# EAGLE design MS-PB16 (EAGLE 6.2)
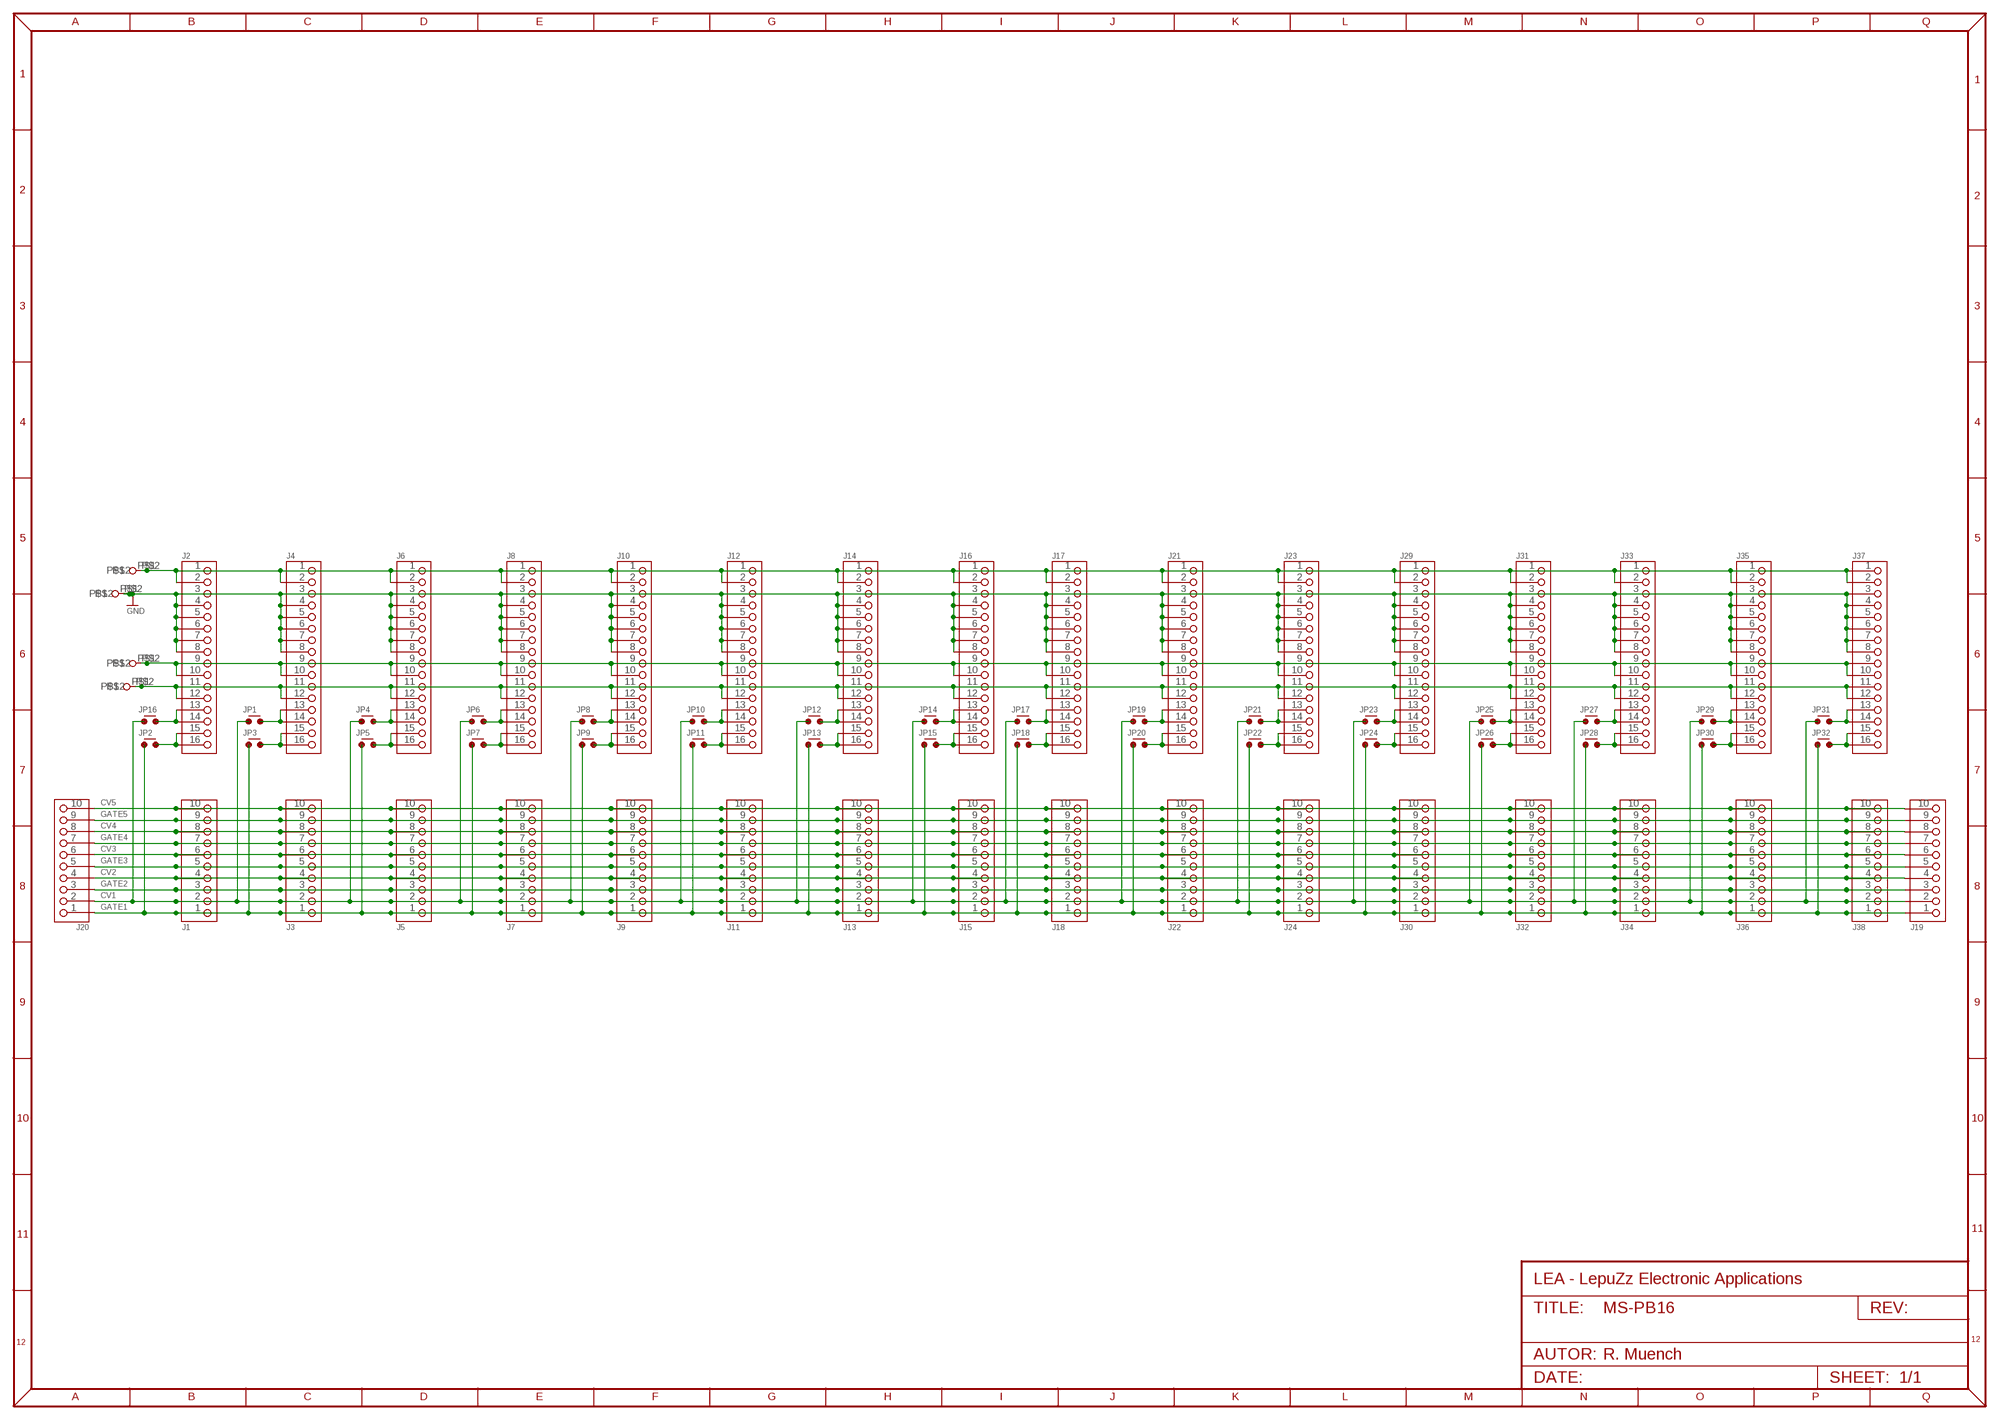
[diagram p0: schematic, sheet 1]

## Parts
J1  CON10PD_S  [PD10S]
J2  CON16_PDS  [PD16S]
J3  CON10PD_S  [PD10S]
J4  CON16_PDS  [PD16S]
J5  CON10PD_S  [PD10S]
J6  CON16_PDS  [PD16S]
J7  CON10PD_S  [PD10S]
J8  CON16_PDS  [PD16S]
J9  CON10PD_S  [PD10S]
J10  CON16_PDS  [PD16S]
J11  CON10PD_S  [PD10S]
J12  CON16_PDS  [PD16S]
J13  CON10PD_S  [PD10S]
J14  CON16_PDS  [PD16S]
J15  CON10PD_S  [PD10S]
J16  CON16_PDS  [PD16S]
J17  CON16_PDS  [PD16S]
J18  CON10PD_S  [PD10S]
J19  CON10PD_S  [PD10S]
J20  CON10PD_S  [PD10S]
J21  CON16_PDS  [PD16S]
J22  CON10PD_S  [PD10S]
J23  CON16_PDS  [PD16S]
J24  CON10PD_S  [PD10S]
J25  FLACHSTECKER-6,35  [FLACHSTECKER-6,35]
J26  FLACHSTECKER-6,35  [FLACHSTECKER-6,35]
J27  FLACHSTECKER-6,35  [FLACHSTECKER-6,35]
J28  FLACHSTECKER-6,35  [FLACHSTECKER-6,35]
J29  CON16_PDS  [PD16S]
J30  CON10PD_S  [PD10S]
J31  CON16_PDS  [PD16S]
J32  CON10PD_S  [PD10S]
J33  CON16_PDS  [PD16S]
J34  CON10PD_S  [PD10S]
J35  CON16_PDS  [PD16S]
J36  CON10PD_S  [PD10S]
J37  CON16_PDS  [PD16S]
J38  CON10PD_S  [PD10S]
JP1  JUMP2J2  [JUMP2]
JP2  JUMP2J2  [JUMP2]
JP3  JUMP2J2  [JUMP2]
JP4  JUMP2J2  [JUMP2]
JP5  JUMP2J2  [JUMP2]
JP6  JUMP2J2  [JUMP2]
JP7  JUMP2J2  [JUMP2]
JP8  JUMP2J2  [JUMP2]
JP9  JUMP2J2  [JUMP2]
JP10  JUMP2J2  [JUMP2]
JP11  JUMP2J2  [JUMP2]
JP12  JUMP2J2  [JUMP2]
JP13  JUMP2J2  [JUMP2]
JP14  JUMP2J2  [JUMP2]
JP15  JUMP2J2  [JUMP2]
JP16  JUMP2J2  [JUMP2]
JP17  JUMP2J2  [JUMP2]
JP18  JUMP2J2  [JUMP2]
JP19  JUMP2J2  [JUMP2]
JP20  JUMP2J2  [JUMP2]
JP21  JUMP2J2  [JUMP2]
JP22  JUMP2J2  [JUMP2]
JP23  JUMP2J2  [JUMP2]
JP24  JUMP2J2  [JUMP2]
JP25  JUMP2J2  [JUMP2]
JP26  JUMP2J2  [JUMP2]
JP27  JUMP2J2  [JUMP2]
JP28  JUMP2J2  [JUMP2]
JP29  JUMP2J2  [JUMP2]
JP30  JUMP2J2  [JUMP2]
JP31  JUMP2J2  [JUMP2]
JP32  JUMP2J2  [JUMP2]

## Nets
+5V: J2.11 J2.12 J4.11 J4.12 J6.11 J6.12 J8.11 J8.12 J10.11 J10.12 J12.11 J12.12 J14.11 J14.12 J16.11 J16.12 J17.11 J17.12 J21.11 J21.12 J23.11 J23.12 J27.P$1 J27.P$2 J29.11 J29.12 J31.11 J31.12 J33.11 J33.12 J35.11 J35.12 J37.11 J37.12
+12V: J2.9 J2.10 J4.9 J4.10 J6.9 J6.10 J8.9 J8.10 J10.9 J10.10 J12.9 J12.10 J14.9 J14.10 J16.9 J16.10 J17.9 J17.10 J21.9 J21.10 J23.9 J23.10 J26.P$1 J26.P$2 J29.9 J29.10 J31.9 J31.10 J33.9 J33.10 J35.9 J35.10 J37.9 J37.10
-12V: J2.1 J2.2 J4.1 J4.2 J6.1 J6.2 J8.1 J8.2 J10.1 J10.2 J12.1 J12.2 J14.1 J14.2 J16.1 J16.2 J17.1 J17.2 J21.1 J21.2 J23.1 J23.2 J25.P$1 J25.P$2 J29.1 J29.2 J31.1 J31.2 J33.1 J33.2 J35.1 J35.2 J37.1 J37.2
CV1: J1.2 J3.2 J5.2 J7.2 J9.2 J11.2 J13.2 J15.2 J18.2 J19.2 J20.2 J22.2 J24.2 J30.2 J32.2 J34.2 J36.2 J38.2 JP1.1 JP4.1 JP6.1 JP8.1 JP10.1 JP12.1 JP14.1 JP16.1 JP17.1 JP19.1 JP21.1 JP23.1 JP25.1 JP27.1 JP29.1 JP31.1
CV2: J1.4 J3.4 J5.4 J7.4 J9.4 J11.4 J13.4 J15.4 J18.4 J19.4 J20.4 J22.4 J24.4 J30.4 J32.4 J34.4 J36.4 J38.4
CV3: J1.6 J3.6 J5.6 J7.6 J9.6 J11.6 J13.6 J15.6 J18.6 J19.6 J20.6 J22.6 J24.6 J30.6 J32.6 J34.6 J36.6 J38.6
CV4: J1.8 J3.8 J5.8 J7.8 J9.8 J11.8 J13.8 J15.8 J18.8 J19.8 J20.8 J22.8 J24.8 J30.8 J32.8 J34.8 J36.8 J38.8
CV5: J1.10 J3.10 J5.10 J7.10 J9.10 J11.10 J13.10 J15.10 J18.10 J19.10 J20.10 J22.10 J24.10 J30.10 J32.10 J34.10 J36.10 J38.10
GATE1: J1.1 J3.1 J5.1 J7.1 J9.1 J11.1 J13.1 J15.1 J18.1 J19.1 J20.1 J22.1 J24.1 J30.1 J32.1 J34.1 J36.1 J38.1 JP2.1 JP3.1 JP5.1 JP7.1 JP9.1 JP11.1 JP13.1 JP15.1 JP18.1 JP20.1 JP22.1 JP24.1 JP26.1 JP28.1 JP30.1 JP32.1
GATE2: J1.3 J3.3 J5.3 J7.3 J9.3 J11.3 J13.3 J15.3 J18.3 J19.3 J20.3 J22.3 J24.3 J30.3 J32.3 J34.3 J36.3 J38.3
GATE3: J1.5 J3.5 J5.5 J7.5 J9.5 J11.5 J13.5 J15.5 J18.5 J19.5 J20.5 J22.5 J24.5 J30.5 J32.5 J34.5 J36.5 J38.5
GATE4: J1.7 J3.7 J5.7 J7.7 J9.7 J11.7 J13.7 J15.7 J18.7 J19.7 J20.7 J22.7 J24.7 J30.7 J32.7 J34.7 J36.7 J38.7
GATE5: J1.9 J3.9 J5.9 J7.9 J9.9 J11.9 J13.9 J15.9 J18.9 J19.9 J20.9 J22.9 J24.9 J30.9 J32.9 J34.9 J36.9 J38.9
GND: J2.3 J2.4 J2.5 J2.6 J2.7 J2.8 J4.3 J4.4 J4.5 J4.6 J4.7 J4.8 J6.3 J6.4 J6.5 J6.6 J6.7 J6.8 J8.3 J8.4 J8.5 J8.6 J8.7 J8.8 J10.3 J10.4 J10.5 J10.6 J10.7 J10.8 J12.3 J12.4 J12.5 J12.6 J12.7 J12.8 J14.3 J14.4 J14.5 J14.6 J14.7 J14.8 J16.3 J16.4 J16.5 J16.6 J16.7 J16.8 J17.3 J17.4 J17.5 J17.6 J17.7 J17.8 J21.3 J21.4 J21.5 J21.6 J21.7 J21.8 J23.3 J23.4 J23.5 J23.6 J23.7 J23.8 J28.P$1 J28.P$2 J29.3 J29.4 J29.5 J29.6 J29.7 J29.8 J31.3 J31.4 J31.5 J31.6 J31.7 J31.8 J33.3 J33.4 J33.5 J33.6 J33.7 J33.8 J35.3 J35.4 J35.5 J35.6 J35.7 J35.8 J37.3 J37.4 J37.5 J37.6 J37.7 J37.8
N$1: J4.13 J4.14 JP1.2
N$2: J2.15 J2.16 JP2.2
N$3: J2.13 J2.14 JP16.2
N$4: J4.15 J4.16 JP3.2
N$5: J6.13 J6.14 JP4.2
N$6: J6.15 J6.16 JP5.2
N$7: J8.15 J8.16 JP7.2
N$8: J8.13 J8.14 JP6.2
N$9: J10.13 J10.14 JP8.2
N$10: J10.15 J10.16 JP9.2
N$11: J12.13 J12.14 JP10.2
N$12: J12.15 J12.16 JP11.2
N$13: J14.13 J14.14 JP12.2
N$14: J14.15 J14.16 JP13.2
N$15: J16.13 J16.14 JP14.2
N$16: J16.15 J16.16 JP15.2
N$17: J17.13 J17.14 JP17.2
N$18: J17.15 J17.16 JP18.2
N$19: J21.13 J21.14 JP19.2
N$20: J21.15 J21.16 JP20.2
N$21: J23.13 J23.14 JP21.2
N$22: J23.15 J23.16 JP22.2
N$23: J29.13 J29.14 JP23.2
N$24: J29.15 J29.16 JP24.2
N$25: J31.13 J31.14 JP25.2
N$26: J31.15 J31.16 JP26.2
N$27: J33.13 J33.14 JP27.2
N$28: J33.15 J33.16 JP28.2
N$29: J35.13 J35.14 JP29.2
N$30: J35.15 J35.16 JP30.2
N$31: J37.13 J37.14 JP31.2
N$32: J37.15 J37.16 JP32.2

## Library data of the parts
J1 J3 J5 J7 J9 J11 J13 J15 J18-J20 J22 J24 J30 J32 J34 J36 J38 = PLUG:CON10: 10pol. Verbinder; ARTNUM: XXX-XXX
J2 J4 J6 J8 J10 J12 J14 J16 J17 J21 J23 J29 J31 J33 J35 J37 = PLUG:CON16: Steckverbinder 16polig; ARTNUM: XXX-XXX
J25-J28 = synth:FLACHSTECKER-6,35
JP1-JP32 = SWITCH:JUMP2

## Board
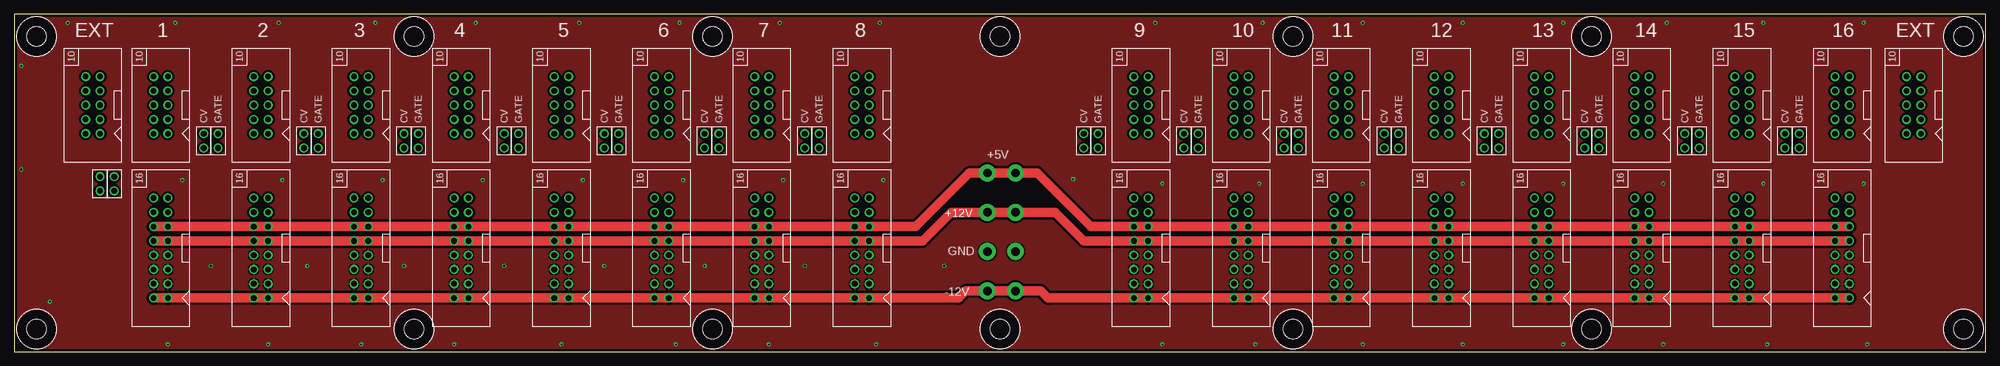
[diagram p1: board, top side]
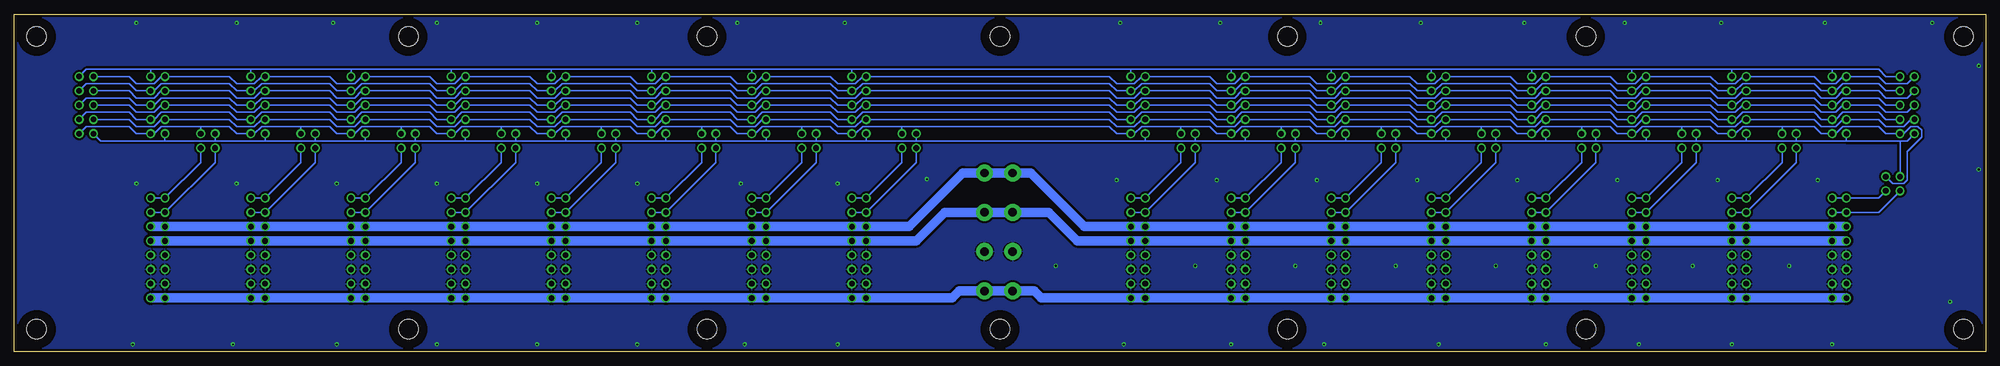
[diagram p2: board, bottom side, seen from below]

Size 350 x 60 mm. Coordinates in mm from the lower left corner, seen from the top.
Outline: 0,0 350,0 350,60 0,60 0,0
Copper layers (1*16): Top 0.035mm / dielectric 1.5mm / Bottom 0.035mm
Design rules: minimum track width 10mil, minimum drill 22mil, track to track 8mil, track to pad 8mil, pad to pad 8mil, via to via 8mil, smd to smd 8mil, copper to edge 20mil, drill to drill 8mil, minimum pad ring 10mil, minimum via ring 8mil, stop-mask expansion 4mil, vias tented up to drill 0mil, thermal gap 10mil

### Footprints (pad centres in the part's own frame; a part is rotated, then mirrored left to right if it is on the bottom)
PD10S = drill 1 pad 1.575: 1 -5.08,-1.27; 2 -5.08,1.27; 3 -2.54,-1.27; 4 -2.54,1.27; 5 0,-1.27; 6 0,1.27; 7 2.54,-1.27; 8 2.54,1.27; 9 5.08,-1.27; 10 5.08,1.27
PD16S = drill 1 pad 1.575: 1 -8.89,-1.27; 2 -8.89,1.27; 3 -6.35,-1.27; 4 -6.35,1.27; 5 -3.81,-1.27; 6 -3.81,1.27; 7 -1.27,-1.27; 8 -1.27,1.27; 9 1.27,-1.27; 10 1.27,1.27; 11 3.81,-1.27; 12 3.81,1.27; 13 6.35,-1.27; 14 6.35,1.27; 15 8.89,-1.27; 16 8.89,1.27
FLACHSTECKER-6,35 = drill 1.5 pad 3: P$1 0,2.5; P$2 0,-2.5
JUMP2 = drill 1 pad 1.575: 1 -1.27,0; 2 1.27,0
BF3,5 = hole 3.5: 0,0

### Placement (x,y rotation side)
J1  26.04,43.81 90 top
J2  26.04,18.41 90 top
J3  43.81,43.81 90 top
J4  43.81,18.41 90 top
J5  61.59,43.81 90 top
J6  61.59,18.41 90 top
J7  79.38,43.81 90 top
J8  79.38,18.41 90 top
J9  97.16,43.81 90 top
J10  97.16,18.41 90 top
J11  114.94,43.81 90 top
J12  114.94,18.41 90 top
J13  132.72,43.81 90 top
J14  132.72,18.41 90 top
J15  150.5,43.81 90 top
J16  150.5,18.41 90 top
J17  200.03,18.41 90 top
J18  200.03,43.81 90 top
J19  13.97,43.81 90 top
J20  337.19,43.81 90 top
J21  217.81,18.41 90 top
J22  217.81,43.81 90 top
J23  235.59,18.41 90 top
J24  235.59,43.81 90 top
J25  175.26,10.79 90 top
J26  175.26,24.77 90 top
J27  175.26,31.75 90 top
J28  175.26,17.78 90 top
J29  253.37,18.41 90 top
J30  253.37,43.81 90 top
J31  271.14,18.41 90 top
J32  271.14,43.81 90 top
J33  288.93,18.41 90 top
J34  288.93,43.81 90 top
J35  306.7,18.41 90 top
J36  306.7,43.81 90 top
J37  324.49,18.41 90 top
J38  324.49,43.81 90 top
JP1  33.66,37.47 270 top
JP2  17.78,29.84 270 top
JP3  36.2,37.47 270 top
JP4  51.44,37.47 270 top
JP5  53.98,37.47 270 top
JP6  69.22,37.47 270 top
JP7  71.75,37.47 270 top
JP8  87,37.47 270 top
JP9  89.53,37.47 270 top
JP10  104.78,37.47 270 top
JP11  107.31,37.47 270 top
JP12  122.56,37.47 270 top
JP13  125.09,37.47 270 top
JP14  140.34,37.47 270 top
JP15  142.88,37.47 270 top
JP16  15.24,29.84 270 top
JP17  189.87,37.47 270 top
JP18  192.41,37.47 270 top
JP19  207.65,37.47 270 top
JP20  210.19,37.47 270 top
JP21  225.43,37.47 270 top
JP22  227.97,37.47 270 top
JP23  243.21,37.47 270 top
JP24  245.75,37.47 270 top
JP25  260.99,37.47 270 top
JP26  263.52,37.47 270 top
JP27  278.76,37.47 270 top
JP28  281.31,37.47 270 top
JP29  296.55,37.47 270 top
JP30  299.08,37.47 270 top
JP31  314.32,37.47 270 top
JP32  316.87,37.47 270 top
U$1  [BF3,5]  227,4 0 top
U$2  [BF3,5]  227,56 0 top
U$4  [BF3,5]  346,56 0 top
U$5  [BF3,5]  346,4 0 top
U$6  [BF3,5]  280,56 0 top
U$7  [BF3,5]  280,4 0 top
U$21  [LEA-MASK]  8.89,1.27 0 top
U$23  [BF3,5]  175,56 0 top
U$24  [BF3,5]  124,56 0 top
U$26  [BF3,5]  71,56 0 top
U$27  [BF3,5]  4,56 0 top
U$28  [BF3,5]  4,4 0 top
U$29  [BF3,5]  71,4 0 top
U$31  [BF3,5]  124,4 0 top
U$32  [BF3,5]  175,4 0 top

### Tracks (layer width: path | path; a pad name or v marks a point on that pad's centre or on a via)
+5V
  Top 1.727: J37.11 J37.12 J35.11 J35.12 J33.11 J33.12 J31.11 J31.12 J29.11 J29.12 J23.11 J23.12 J21.11 J21.12 J17.11 J17.12 191.13,22.23 181.61,31.75 169.54,31.75 160.02,22.23 J16.11 J16.12 J14.11 J14.12 J12.11 J12.12 J10.11 J10.12 J8.11 J8.12 J6.11 J6.12 J4.11 J4.12 J2.11 J2.12
  Bottom 1.727: J2.12 J2.11 J4.12 J4.11 J6.12 J6.11 J8.12 J8.11 J10.12 J10.11 J12.12 J12.11 J14.12 J14.11 J16.12 J16.11 160.02,22.23 169.54,31.75 J27.P$1 J27.P$2 181.61,31.75 191.13,22.23 J17.12 J17.11 J21.12 J21.11 J23.12 J23.11 J29.12 J29.11 J31.12 J31.11 J33.12 J33.11 J35.12 J35.11 J37.12 J37.11
+12V
  Top 1.727: J2.10 J2.9 J4.10 J4.9 J6.10 J6.9 J8.10 J8.9 J10.10 J10.9 J12.10 J12.9 J14.10 J14.9 J16.10 J16.9 161.29,19.68 166.37,24.77 184.78,24.77 189.87,19.68 J17.10 J17.9 J21.10 J21.9 J23.10 J23.9 J29.10 J29.9 J31.10 J31.9 J33.10 J33.9 J35.10 J35.9 J37.10 J37.9
  Bottom 1.727: J2.10 J2.9 J4.10 J4.9 J6.10 J6.9 J8.10 J8.9 J10.10 J10.9 J12.10 J12.9 J14.10 J14.9 J16.10 J16.9 161.29,19.68 166.37,24.77 J26.P$1 J26.P$2 184.78,24.77 189.87,19.68 J17.10 J17.9 J21.10 J21.9 J23.10 J23.9 J29.10 J29.9 J31.10 J31.9 J33.10 J33.9 J35.10 J35.9 J37.10 J37.9
-12V
  Top 1.727: J37.1 J37.2 J35.1 J33.1 J33.2 J31.1 J31.2 J29.1 J29.2 J23.1 J23.2 J21.1 J21.2 J17.1 J17.2 183.51,9.53 182.25,10.79 168.91,10.79 167.64,9.53 J16.1 J16.2 J14.1 J14.2 J12.1 J12.2 J10.1 J10.2 J8.1 J8.2 J6.1 J6.2 J4.1 J4.2 J2.1 J2.2
  Bottom 1.727: J2.2 J2.1 J4.2 J4.1 J6.2 J6.1 J8.2 J8.1 J10.2 J10.1 J12.2 J12.1 J14.2 J14.1 J16.2 J16.1 167.64,9.53 168.91,10.79 J25.P$1 J25.P$2 182.25,10.79 183.51,9.53 J17.2 J17.1 J21.2 J21.1 J23.2 J23.1 J29.2 J29.1 J31.2 J31.1 J33.2 J33.1 J35.2 J35.1 J37.2 J37.1
CV1
  Bottom 0.305: 42.55,37.47 51.44,37.47 | 51.44,37.47 60.33,37.47 | 24.77,37.47 33.66,37.47 | J1.2 24.77,37.47 | 24.77,37.47 15.24,37.47 | 15.24,37.47 13.97,37.47 J19.2 | JP1.1 33.66,37.47 | 33.66,37.47 42.55,37.47 | 42.55,37.47 J3.2 | JP4.1 51.44,37.47 | J5.2 60.33,37.47 | 60.33,37.47 69.22,37.47 | 69.22,37.47 78.11,37.47 | 78.11,37.47 87,37.47 | 87,37.47 95.89,37.47 | 95.89,37.47 104.78,37.47 | 104.78,37.47 113.67,37.47 | 113.67,37.47 122.56,37.47 | 122.56,37.47 131.44,37.47 | 131.44,37.47 140.34,37.47 | 140.34,37.47 149.22,37.47 | JP14.1 140.34,37.47 | J13.2 131.44,37.47 | JP12.1 122.56,37.47 | J11.2 113.67,37.47 | JP10.1 104.78,37.47 | JP8.1 87,37.47 | J9.2 95.89,37.47 | JP6.1 69.22,37.47 | J7.2 78.11,37.47 | J15.2 149.22,37.47 | 149.22,37.47 189.87,37.47 | 189.87,37.47 198.75,37.47 | JP17.1 189.87,37.47 | J18.2 198.75,37.47 | 198.75,37.47 207.65,37.47 | 207.65,37.47 216.53,37.47 | 216.53,37.47 225.43,37.47 | 225.43,37.47 234.31,37.47 | 234.31,37.47 243.21,37.47 | 243.21,37.47 252.09,37.47 | 252.09,37.47 260.99,37.47 | 260.99,37.47 269.88,37.47 | 269.88,37.47 278.76,37.47 | 278.76,37.47 287.65,37.47 | 287.65,37.47 296.55,37.47 | 296.55,37.47 305.44,37.47 | 305.44,37.47 314.32,37.47 | 314.32,37.47 323.21,37.47 | 323.21,37.47 334.64,37.47 J20.2 | JP16.1 15.24,37.47 | J38.2 323.21,37.47 | JP31.1 314.32,37.47 | J36.2 305.44,37.47 | JP29.1 296.55,37.47 | J34.2 287.65,37.47 | JP27.1 278.76,37.47 | J32.2 269.88,37.47 | JP25.1 260.99,37.47 | J30.2 252.09,37.47 | JP23.1 243.21,37.47 | J24.2 234.31,37.47 | JP19.1 207.65,37.47 | J22.2 216.53,37.47 | JP21.1 225.43,37.47
CV2
  Bottom 0.305: J20.4 329.56,41.27 328.3,40.01 325.12,40.01 323.85,41.27 J38.4 311.79,41.27 310.51,40.01 307.34,40.01 306.07,41.27 J36.4 294,41.27 292.74,40.01 289.56,40.01 288.29,41.27 J34.4 276.23,41.27 274.95,40.01 271.78,40.01 270.51,41.27 J32.4 258.44,41.27 257.18,40.01 254,40.01 252.73,41.27 J30.4 240.66,41.27 239.4,40.01 236.22,40.01 234.95,41.27 J24.4 222.88,41.27 221.62,40.01 218.44,40.01 217.17,41.27 J22.4 205.1,41.27 203.84,40.01 200.66,40.01 199.39,41.27 J18.4 155.57,41.27 154.31,40.01 151.13,40.01 149.86,41.27 J15.4 137.79,41.27 136.53,40.01 133.35,40.01 132.08,41.27 J13.4 120.02,41.27 118.75,40.01 115.57,40.01 114.3,41.27 J11.4 102.23,41.27 100.97,40.01 97.79,40.01 96.52,41.27 J9.4 84.45,41.27 83.19,40.01 80.01,40.01 78.74,41.27 J7.4 66.67,41.27 65.41,40.01 62.23,40.01 60.96,41.27 J5.4 48.9,41.27 47.62,40.01 44.45,40.01 43.18,41.27 J3.4 30.48,41.27 29.21,40.01 26.67,40.01 25.4,41.27 J1.4 19.05,41.27 17.78,40.01 14.61,40.01 13.34,41.27 J19.4
CV3
  Bottom 0.305: J20.6 329.56,43.81 328.3,42.55 325.12,42.55 323.85,43.81 J38.6 311.79,43.81 310.51,42.55 307.34,42.55 306.07,43.81 J36.6 294,43.81 292.74,42.55 289.56,42.55 288.29,43.81 J34.6 276.23,43.81 274.95,42.55 271.78,42.55 270.51,43.81 J32.6 258.44,43.81 257.18,42.55 254,42.55 252.73,43.81 J30.6 240.66,43.81 239.4,42.55 236.22,42.55 234.95,43.81 J24.6 222.88,43.81 221.62,42.55 218.44,42.55 217.17,43.81 J22.6 205.1,43.81 203.84,42.55 200.66,42.55 199.39,43.81 J18.6 155.57,43.81 154.31,42.55 151.13,42.55 149.86,43.81 J15.6 137.79,43.81 136.53,42.55 133.35,42.55 132.08,43.81 J13.6 120.02,43.81 118.75,42.55 115.57,42.55 114.3,43.81 J11.6 102.23,43.81 100.97,42.55 97.79,42.55 96.52,43.81 J9.6 84.45,43.81 83.19,42.55 80.01,42.55 78.74,43.81 J7.6 66.67,43.81 65.41,42.55 62.23,42.55 60.96,43.81 J5.6 48.9,43.81 47.62,42.55 44.45,42.55 43.18,43.81 J3.6 30.48,43.81 29.21,42.55 26.67,42.55 25.4,43.81 J1.6 19.05,43.81 17.78,42.55 13.97,42.55 J19.6
CV4
  Bottom 0.305: J20.8 329.56,46.35 328.3,45.09 325.12,45.09 323.85,46.35 J38.8 311.79,46.35 310.51,45.09 307.34,45.09 306.07,46.35 J36.8 294,46.35 292.74,45.09 289.56,45.09 288.29,46.35 J34.8 276.23,46.35 274.95,45.09 271.78,45.09 270.51,46.35 J32.8 258.44,46.35 257.18,45.09 254,45.09 252.73,46.35 J30.8 240.66,46.35 239.4,45.09 236.22,45.09 234.95,46.35 J24.8 222.88,46.35 221.62,45.09 218.44,45.09 217.17,46.35 J22.8 205.1,46.35 203.84,45.09 200.66,45.09 199.39,46.35 J18.8 155.57,46.35 154.31,45.09 151.13,45.09 149.86,46.35 J15.8 137.79,46.35 136.53,45.09 133.35,45.09 132.08,46.35 J13.8 120.02,46.35 118.75,45.09 115.57,45.09 114.3,46.35 J11.8 102.23,46.35 100.97,45.09 97.79,45.09 96.52,46.35 J9.8 84.45,46.35 83.19,45.09 80.01,45.09 78.74,46.35 J7.8 66.67,46.35 65.41,45.09 62.23,45.09 60.96,46.35 J5.8 48.9,46.35 47.62,45.09 44.45,45.09 43.18,46.35 J3.8 30.48,46.35 29.21,45.09 26.67,45.09 25.4,46.35 J1.8 19.05,46.35 17.78,45.09 13.97,45.09 J19.8
CV5
  Bottom 0.305: J20.10 329.56,48.9 328.3,47.62 325.12,47.62 323.85,48.9 J38.10 311.79,48.9 310.51,47.62 307.34,47.62 306.07,48.9 J36.10 294,48.9 292.74,47.62 289.56,47.62 288.29,48.9 J34.10 276.23,48.9 274.95,47.62 271.78,47.62 270.51,48.9 J32.10 258.44,48.9 257.18,47.62 254,47.62 252.73,48.9 J30.10 240.66,48.9 239.4,47.62 236.22,47.62 234.95,48.9 J24.10 222.88,48.9 221.62,47.62 218.44,47.62 217.17,48.9 J22.10 205.1,48.9 203.84,47.62 200.66,47.62 199.39,48.9 J18.10 155.57,48.9 154.31,47.62 151.13,47.62 149.86,48.9 J15.10 137.79,48.9 136.53,47.62 133.35,47.62 132.08,48.9 J13.10 120.02,48.9 118.75,47.62 115.57,47.62 114.3,48.9 J11.10 102.23,48.9 100.97,47.62 97.79,47.62 96.52,48.9 J9.10 84.45,48.9 83.19,47.62 80.01,47.62 78.74,48.9 J7.10 66.67,48.9 65.41,47.62 62.23,47.62 60.96,48.9 J5.10 48.9,48.9 47.62,47.62 44.45,47.62 43.18,48.9 J3.10 30.48,48.9 29.21,47.62 26.67,47.62 25.4,48.9 J1.10 19.05,48.9 17.78,47.62 13.97,47.62 J19.10
GATE1
  Bottom 0.305: 53.98,40.01 48.9,40.01 47.62,38.73 J3.1 44.45,38.73 43.18,40.01 36.2,40.01 | 53.98,40.01 60.96,40.01 62.23,38.73 J5.1 65.41,38.73 66.67,40.01 71.75,40.01 | 36.2,40.01 30.48,40.01 29.21,38.73 J1.1 26.67,38.73 25.4,40.01 19.05,40.01 17.78,38.73 J19.1 14.61,38.73 13.34,40.01 12.06,40.01 11.43,39.37 11.43,38.1 13.97,35.56 13.97,30.48 14.61,29.84 16.51,29.84 JP2.1 | 36.2,40.01 JP3.1 | JP5.1 53.98,40.01 | 71.75,40.01 78.74,40.01 80.01,38.73 J7.1 83.19,38.73 84.45,40.01 89.53,40.01 | JP7.1 71.75,40.01 | JP9.1 89.53,40.01 | 89.53,40.01 96.52,40.01 97.79,38.73 J9.1 100.97,38.73 102.23,40.01 107.31,40.01 | JP11.1 107.31,40.01 | 107.31,40.01 114.3,40.01 115.57,38.73 J11.1 118.75,38.73 120.02,40.01 125.09,40.01 | JP13.1 125.09,40.01 | 125.09,40.01 132.08,40.01 133.35,38.73 J13.1 136.53,38.73 137.79,40.01 142.88,40.01 | JP15.1 142.88,40.01 | 142.88,40.01 149.86,40.01 151.13,38.73 J15.1 154.31,38.73 155.57,40.01 192.41,40.01 | JP18.1 192.41,40.01 | 192.41,40.01 199.39,40.01 200.66,38.73 J18.1 203.84,38.73 205.1,40.01 210.19,40.01 | 210.19,40.01 217.17,40.01 218.44,38.73 J22.1 221.62,38.73 222.88,40.01 227.97,40.01 | 227.97,40.01 234.95,40.01 236.22,38.73 J24.1 239.4,38.73 240.66,40.01 245.75,40.01 | 245.75,40.01 252.73,40.01 254,38.73 J30.1 257.18,38.73 258.44,40.01 263.52,40.01 | 263.52,40.01 270.51,40.01 271.78,38.73 J32.1 274.95,38.73 276.23,40.01 281.31,40.01 | 281.31,40.01 288.29,40.01 289.56,38.73 J34.1 292.74,38.73 294,40.01 299.08,40.01 | 299.08,40.01 306.07,40.01 307.34,38.73 J36.1 310.51,38.73 311.79,40.01 316.87,40.01 | 316.87,40.01 323.85,40.01 325.12,38.73 J38.1 328.3,38.73 329.56,40.01 337.19,40.01 J20.1
  Bottom 0.305: JP20.1 210.19,40.01 | JP22.1 227.97,40.01 | JP24.1 245.75,40.01 | JP26.1 263.52,40.01 | JP28.1 281.31,40.01 | JP30.1 299.08,40.01 | JP32.1 316.87,40.01
GATE2
  Bottom 0.305: J20.3 337.19,42.55 329.56,42.55 328.3,41.27 J38.3 325.12,41.27 323.85,42.55 311.79,42.55 310.51,41.27 J36.3 307.34,41.27 306.07,42.55 294,42.55 292.74,41.27 J34.3 289.56,41.27 288.29,42.55 276.23,42.55 274.95,41.27 J32.3 271.78,41.27 270.51,42.55 258.44,42.55 257.18,41.27 J30.3 254,41.27 252.73,42.55 240.66,42.55 239.4,41.27 J24.3 236.22,41.27 234.95,42.55 222.88,42.55 221.62,41.27 J22.3 218.44,41.27 217.17,42.55 205.1,42.55 203.84,41.27 J18.3 200.66,41.27 199.39,42.55 155.57,42.55 154.31,41.27 J15.3 151.13,41.27 149.86,42.55 137.79,42.55 136.53,41.27 J13.3 133.35,41.27 132.08,42.55 120.02,42.55 118.75,41.27 J11.3 115.57,41.27 114.3,42.55 102.23,42.55 100.97,41.27 J9.3 97.79,41.27 96.52,42.55 84.45,42.55 83.19,41.27 J7.3 80.01,41.27 78.74,42.55 66.67,42.55 65.41,41.27 J5.3 62.23,41.27 60.96,42.55 48.9,42.55 47.62,41.27 J3.3 44.45,41.27 43.18,42.55 30.48,42.55 29.21,41.27 J1.3 26.67,41.27 25.4,42.55 19.05,42.55 17.78,41.27 J19.3
GATE3
  Bottom 0.305: J20.5 337.19,45.09 329.56,45.09 328.3,43.81 J38.5 325.12,43.81 323.85,45.09 311.79,45.09 310.51,43.81 J36.5 307.34,43.81 306.07,45.09 294,45.09 292.74,43.81 J34.5 289.56,43.81 288.29,45.09 276.23,45.09 274.95,43.81 J32.5 271.78,43.81 270.51,45.09 258.44,45.09 257.18,43.81 J30.5 254,43.81 252.73,45.09 240.66,45.09 239.4,43.81 J24.5 236.22,43.81 234.95,45.09 222.88,45.09 221.62,43.81 J22.5 218.44,43.81 217.17,45.09 205.1,45.09 203.84,43.81 J18.5 200.66,43.81 199.39,45.09 155.57,45.09 154.31,43.81 J15.5 151.13,43.81 149.86,45.09 137.79,45.09 136.53,43.81 J13.5 133.35,43.81 132.08,45.09 120.02,45.09 118.75,43.81 J11.5 115.57,43.81 114.3,45.09 102.23,45.09 100.97,43.81 J9.5 97.79,43.81 96.52,45.09 84.45,45.09 83.19,43.81 J7.5 80.01,43.81 78.74,45.09 66.67,45.09 65.41,43.81 J5.5 62.23,43.81 60.96,45.09 48.9,45.09 47.62,43.81 J3.5 44.45,43.81 43.18,45.09 30.48,45.09 29.21,43.81 J1.5 26.67,43.81 25.4,45.09 19.05,45.09 17.78,43.81 J19.5
GATE4
  Bottom 0.305: J20.7 337.19,47.62 329.56,47.62 328.3,46.35 J38.7 325.12,46.35 323.85,47.62 311.79,47.62 310.51,46.35 J36.7 307.34,46.35 306.07,47.62 294,47.62 292.74,46.35 J34.7 289.56,46.35 288.29,47.62 276.23,47.62 274.95,46.35 J32.7 271.78,46.35 270.51,47.62 258.44,47.62 257.18,46.35 J30.7 254,46.35 252.73,47.62 240.66,47.62 239.4,46.35 J24.7 236.22,46.35 234.95,47.62 222.88,47.62 221.62,46.35 J22.7 218.44,46.35 217.17,47.62 205.1,47.62 203.84,46.35 J18.7 200.66,46.35 199.39,47.62 155.57,47.62 154.31,46.35 J15.7 151.13,46.35 149.86,47.62 137.79,47.62 136.53,46.35 J13.7 133.35,46.35 132.08,47.62 120.02,47.62 118.75,46.35 J11.7 115.57,46.35 114.3,47.62 102.23,47.62 100.97,46.35 J9.7 97.79,46.35 96.52,47.62 84.45,47.62 83.19,46.35 J7.7 80.01,46.35 78.74,47.62 66.67,47.62 65.41,46.35 J5.7 62.23,46.35 60.96,47.62 48.9,47.62 47.62,46.35 J3.7 44.45,46.35 43.18,47.62 30.48,47.62 29.21,46.35 J1.7 26.67,46.35 25.4,47.62 19.05,47.62 17.78,46.35 J19.7
GATE5
  Bottom 0.305: J1.9 27.3,50.16 | 27.3,50.16 45.09,50.16 | J3.9 45.09,50.16 | 45.09,50.16 62.87,50.16 | J5.9 62.87,50.16 | 62.87,50.16 80.64,50.16 | 80.64,50.16 98.42,50.16 | 98.42,50.16 116.2,50.16 | 116.2,50.16 133.99,50.16 | 133.99,50.16 151.76,50.16 | J7.9 80.64,50.16 | J9.9 98.42,50.16 | J11.9 116.2,50.16 | J13.9 133.99,50.16 | J15.9 151.76,50.16 | 151.76,50.16 201.29,50.16 | J18.9 201.29,50.16 | 201.29,50.16 219.07,50.16 | 219.07,50.16 236.85,50.16 | 236.85,50.16 254.63,50.16 | 254.63,50.16 272.42,50.16 | 272.42,50.16 290.19,50.16 | 290.19,50.16 307.98,50.16 | 307.98,50.16 325.75,50.16 | 325.75,50.16 337.19,50.16 J20.9 | J19.9 17.78,48.9 19.05,50.16 27.3,50.16 | J22.9 219.07,50.16 | J24.9 236.85,50.16 | J32.9 272.42,50.16 | J30.9 254.63,50.16 | J34.9 290.19,50.16 | J36.9 307.98,50.16 | J38.9 325.75,50.16
GND  (via drill 0.3 pad 0.51)
  other vias: 29.84,30.48 47.62,30.48 65.41,30.48 83.19,30.48 100.97,30.48 118.75,30.48 136.53,30.48 154.31,30.48 203.84,29.84 9.53,58.42 28.57,58.42 46.99,58.42 64.14,58.42 81.92,58.42 100.33,58.42 118.11,58.42 135.89,58.42 153.67,58.42 221.62,58.42 202.56,58.42 187.96,30.66 203.84,1.27 153.03,1.27 133.99,1.27 117.47,1.27 97.16,1.27 45.09,1.27 61.59,1.27 78.11,1.27 27.3,1.27 6.35,8.89 1.27,50.8 1.27,32.38 34.92,15.24 52.07,15.24 69.22,15.24 87,15.24 104.78,15.24 122.56,15.24 140.34,15.24 165.1,15.24 220.98,29.84 239.4,29.84 257.18,29.84 274.95,29.84 292.74,29.84 310.51,29.84 328.3,29.84 239.4,58.42 257.18,58.42 274.95,58.42 293.37,58.42 310.51,58.42 328.3,58.42 220.34,1.27 239.4,1.27 257.18,1.27 274.95,1.27 292.74,1.27 311.15,1.27 328.93,1.27
  pour Bottom (isolate 0.381): 0,0 350,0 350,60 0,60
  pour Top (isolate 0.381): 0,0 350,0 350,60 0,60
N$1
  Bottom 0.305: J4.13 J4.14 33.66,33.66 JP1.2
N$2
  Bottom 0.305: J2.15 J2.16 19.05,27.3 JP2.2
N$3
  Bottom 0.305: J2.13 J2.14 19.05,24.77 JP16.2
N$4
  Bottom 0.305: J4.15 J4.16 36.2,33.66 JP3.2
N$5
  Bottom 0.305: JP4.2 51.44,33.66 J6.14 J6.13
N$6
  Bottom 0.305: JP5.2 53.98,33.66 J6.16 J6.15
N$7
  Bottom 0.305: JP7.2 71.75,33.66 J8.16 J8.15
N$8
  Bottom 0.305: JP6.2 69.22,33.66 J8.14 J8.13
N$9
  Bottom 0.305: JP8.2 87,33.66 J10.14 J10.13
N$10
  Bottom 0.305: JP9.2 89.53,33.66 J10.16 J10.15
N$11
  Bottom 0.305: JP10.2 104.78,33.66 J12.14 J12.13
N$12
  Bottom 0.305: JP11.2 107.31,33.66 J12.16 J12.15
N$13
  Bottom 0.305: JP12.2 122.56,33.66 J14.14 J14.13
N$14
  Bottom 0.305: JP13.2 125.09,33.66 J14.16 J14.15
N$15
  Bottom 0.305: JP14.2 140.34,33.66 J16.14 J16.13
N$16
  Bottom 0.305: JP15.2 142.88,33.66 J16.16 J16.15
N$17
  Bottom 0.305: JP17.2 189.87,33.66 J17.14 J17.13
N$18
  Bottom 0.305: JP18.2 192.41,33.66 J17.16 J17.15
N$19
  Bottom 0.305: J21.13 J21.14 207.65,33.66 JP19.2
N$20
  Bottom 0.305: J21.15 J21.16 210.19,33.66 JP20.2
N$21
  Bottom 0.305: J23.13 J23.14 225.43,33.66 JP21.2
N$22
  Bottom 0.305: J23.15 J23.16 227.97,33.66 JP22.2
N$23
  Bottom 0.305: J29.13 J29.14 243.21,33.66 JP23.2
N$24
  Bottom 0.305: J29.15 J29.16 245.75,33.66 JP24.2
N$25
  Bottom 0.305: J31.13 J31.14 260.99,33.66 JP25.2
N$26
  Bottom 0.305: J31.15 J31.16 263.52,33.66 JP26.2
N$27
  Bottom 0.305: J33.13 J33.14 278.76,33.66 JP27.2
N$28
  Bottom 0.305: J33.15 J33.16 281.31,33.66 JP28.2
N$29
  Bottom 0.305: J35.13 J35.14 296.55,33.66 JP29.2
N$30
  Bottom 0.305: J35.15 J35.16 299.08,33.66 JP30.2
N$31
  Bottom 0.305: J37.13 J37.14 314.32,33.66 JP31.2
N$32
  Bottom 0.305: J37.15 J37.16 316.87,33.66 JP32.2

### Text on the board
tPlace: +5V | +12V | GND | -12V
tNames: EXT | 1 | 2 | 3 | 4 | 5 | 6 | 7 | 8 | 9 | 10 | 11 | 12 | 13 | 14 | 15 | 16 | EXT | CV | GATE | CV | GATE | CV | GATE | CV | GATE | CV | GATE | CV | GATE | CV | GATE | CV | GATE | CV | GATE | CV | GATE | CV | GATE | CV | GATE | CV | GATE | CV | GATE | CV | GATE
tStop: MS-PB9 | R0 | 1320